# Altium schematic sheet MCU_Power.SchDoc
size A4; SheetNumber: 2; SheetTotal: 4
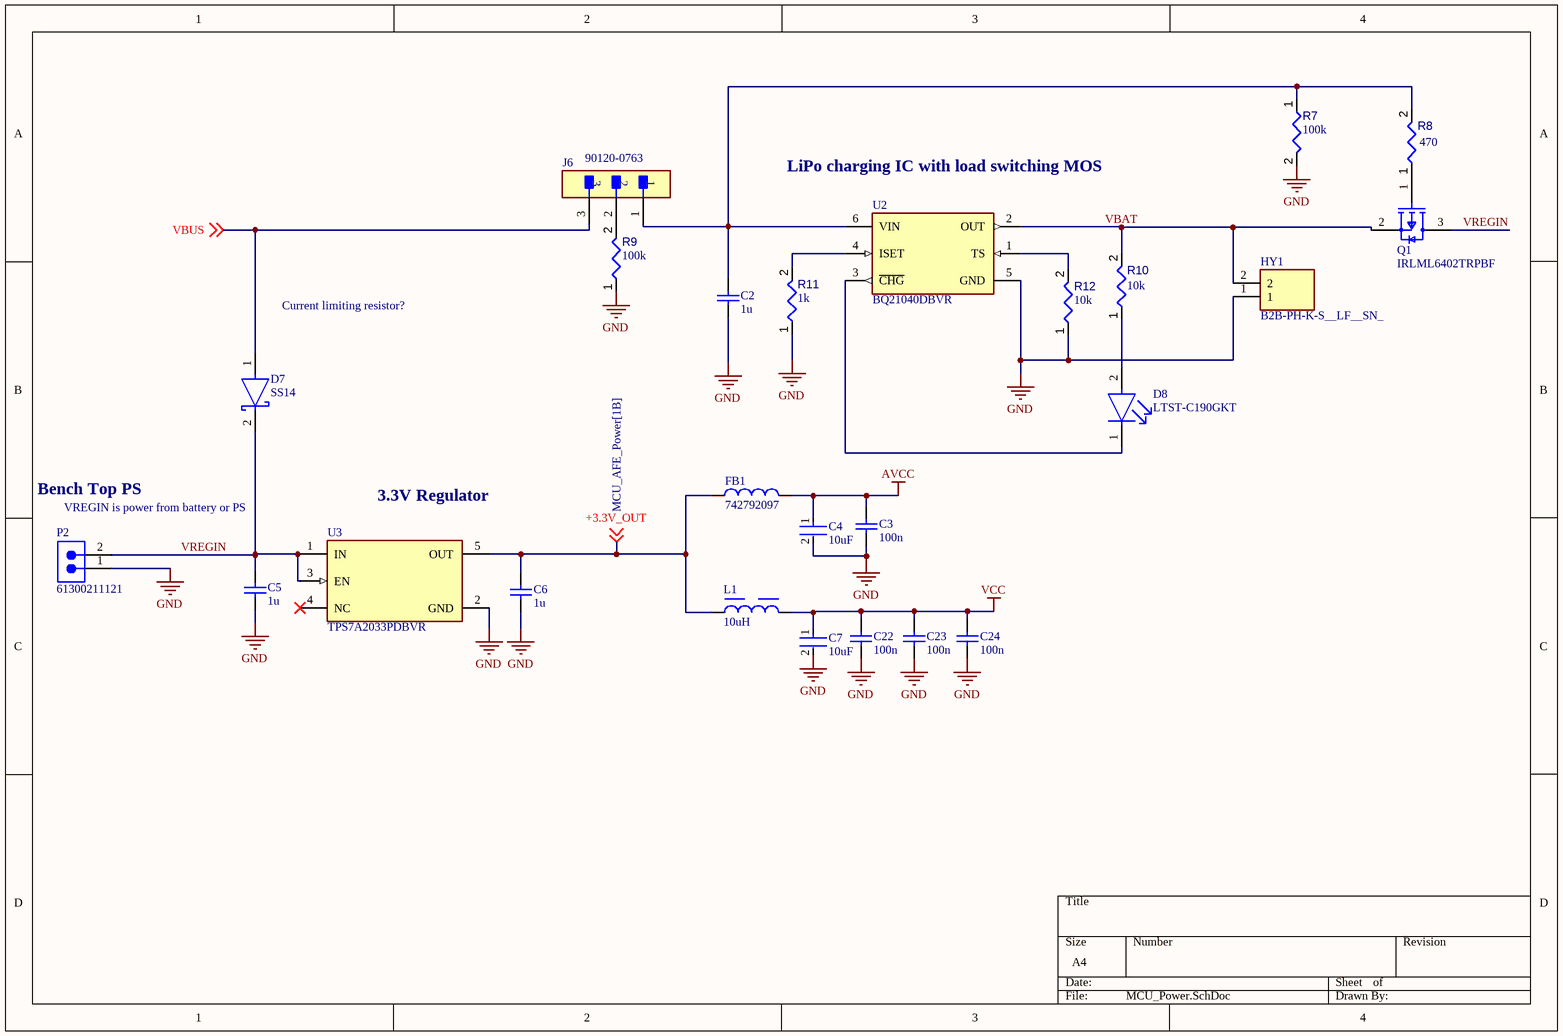
[diagram p0: MCU_Power.SchDoc]

## Parts
C2  1u  [WCAP-CSGP_0402_L1W0.5H0.5]
C3  100n  [WCAP-CSGP_0402_L1W0.5H0.5]
C4  10uF  [FP-GRM188-0_1-e0_2_0_55-IPC_A]
C5  1u  [WCAP-CSGP_0402_L1W0.5H0.5]
C6  1u  [WCAP-CSGP_0402_L1W0.5H0.5]
C7  10uF  [FP-GRM188-0_1-e0_2_0_55-IPC_A]
C22  100n  [WCAP-CSGP_0402_L1W0.5H0.5]
C23  100n  [WCAP-CSGP_0402_L1W0.5H0.5]
C24  100n  [WCAP-CSGP_0402_L1W0.5H0.5]
D7  SS14  [FP-403AE-MFG]
D8  LTST-C190GKT  [FP-LTST-C190GKT-MFG]
FB1  742792097  [WE-CBF_0805_L2W1.2H0.9_HC]
HY1  B2B-PH-K-S__LF__SN_  [B2BPHKSLFSN]
J6  90120-0763  [FP-90120-0763-MFG]
L1  10uH  [WE-LQS_2010]
P2  61300211121  [61300211121]
Q1  IRLML6402TRPBF  [FP-Micro3-MFG]
R7  value 100k  [RESC1005X40X25ML05T05]  (hidden comment: Resistor 4k7 +/-1% 0402 63 mW)
R8  value 470  [RESC1005X40X25ML05T05]  (hidden comment: Resistor 4k7 +/-1% 0402 63 mW)
R9  value 100k  [RESC1005X40X25ML05T05]  (hidden comment: Resistor 4k7 +/-1% 0402 63 mW)
R10  value 10k  [RESC1005X40X25ML05T05]  (hidden comment: Resistor 4k7 +/-1% 0402 63 mW)
R11  value 1k  [RESC1005X40X25ML05T05]  (hidden comment: Resistor 4k7 +/-1% 0402 63 mW)
R12  value 10k  [RESC1005X40X25ML05T05]  (hidden comment: Resistor 4k7 +/-1% 0402 63 mW)
U2  BQ21040DBVR  [FP-DBV0006A-MFG]
U3  TPS7A2033PDBVR  [FP-DBV0005A-MFG]

## Nets
AVCC: C3.2 C4.1 FB1.2
GND: C2.1 C3.1 C4.2 C5.1 C6.1 C7.2 C22.1 C23.1 C24.1 HY1.1 P2.1 R7.2 R9.1 R11.1 R12.1 U2.5(GND) U3.2(GND)
VCC: C7.1 C22.2 C23.2 C24.2 L1.2
+3.3V_OUT: C6.2 FB1.1 L1.1 U3.5(OUT) ; off-sheet +3.3V_OUT
VBAT: HY1.2 Q1.2(S) R10.2 U2.2(OUT)
VBUS: D7.1(A) J6.3 ; off-sheet VBUS
VREGIN: C5.2 D7.2(C) P2.2 Q1.3(D) U3.1(IN) U3.3(EN)
NetC2_2: C2.2 J6.1 R7.1 R8.2 U2.6(VIN)
NetD8_1: D8.1(C) U2.3(~{CHG})
NetD8_2: D8.2(A) R10.1
NetJ6_2: J6.2 R9.2
NetQ1_1: Q1.1(G) R8.1
NetR11_2: R11.2 U2.4(ISET)
NetR12_2: R12.2 U2.1(TS)

Not connected (* = marked no-connect by the designer): U3 4(NC)*

## Notes on the sheet
- (near U2) LiPo charging IC with load switching MOS
- Current limiting resistor?
- Bench Top PS
- (near P2) VREGIN is power from battery or PS
- (near U3) 3.3V Regulator

## Library data of the parts
C2 C3 C5 C6 C22-C24 = CMP-207839-000017-2: CAP CER 10000PF 50V X7R 0402; NexarPartId: 53703204; Insulation Resistance: 10GΩ; Material: Ceramic; Tolerance: 10%; Capacitance: 10nF; Packaging: Tape & Reel (TR); Voltage Rating: 50V; Thickness: 558.8µm; Case Code (Imperial): 0402; Dielectric: X7R; Mount: Surface Mount; Width: 500µm; Height: 500µm; Min Operating Temperature: -55°C; Case/Package: 0402; RoHS: Compliant; Case Code (Metric): 1005; REACH SVHC: Unknown; Max Operating Temperature: 125°C; Voltage Rating (DC): 50V; Length: 1mm
C4 C7 = CMP-2006-02792-2: Chip Multilayer Ceramic Capacitors for General Purpose, 0603, 10uF, X5R, 15%, 20%, 6.3V; Packaging: Tape and Reel; Voltage Rating (DC): 6.3V; Width: 0.031inch; Termination: SMD/SMT; Dielectric: X5R; Package Quantity: 4000; Voltage Rating: 6.3V; Capacitance: 10uF; Case/Package: 0603; Min Operating Temperature: -55°C; Voltage: 6.3V; Length: 1.6mm; Thickness: 0.035inch; Lead Free: Lead Free; Depth: 0.8mm; Case Code (Imperial): 0603; Max Operating Temperature: 85°C; Material: Ceramic; Height: 0.8mm; Tolerance: 20%; Mount: Surface Mount; REACH SVHC: No SVHC; Radiation Hardening: No; Case Code (Metric): 1608
D7 = CMP-2000-04943-2: DIODE SCHOTTKY 40V 1A SMA; Manufacturer: ON Semiconductor; Peak Reverse Current: 0.2mA; Max Junction Temp: +125°C; Standoff Height: 0.05mm; Max Surge Forward Current: 40A; Mouser Description: Schottky Diodes & Rectifiers SMA 40V 1.0A; RoHS: TRUE; Lead Free: Yes; Manufacturer Part Number: SS14; Device Class L3: Schottky Diodes; Category: Diode; Automotive: No; Digikey Description: DIODE SCHOTTKY 40V 1A SMA; ComponentLink2Description: Datasheet; Device Class L2: Diodes; Height: 2.5mm; Temperature Range High: +125°C; ComponentLink2URL: https://www.onsemi.com/pub/Collateral/SS19-D.PDF; Device Class L1: Discrete Semiconductors; Package: 403AE; Octopart: https://octopart.com/ss14-on+semiconductor-29205033; Max Repetitive Reverse Voltage: 40V; Temperature Range Low: -65°C; Forward Current: 1A; Temperature: -65°C to +125°C
D8 = CMP-22017-000005-2: LED GREEN CLEAR CHIP SMD; Dominant Wavelength: 569nm; Reverse Voltage: 5V; Lens Color: Colorless; Viewing Angle: 130°; Voltage: 2V; Forward Current: 30mA; Power Dissipation: 100mW; Luminous Intensity: 6mcd; Number of LEDs: 1; Forward Voltage: 2.1V; Wavelength: 565nm; Test Current: 10mA; Min Operating Temperature: -55°C; Lens Style: Clear; Mount: Surface Mount; Width: 0.8mm; Packaging: Tape and Reel; Lens Transparency: Clear; Case Code (Metric): 1608; Depth: 0.8mm; Case Code (Imperial): 0603; Case/Package: 0603; Number of Pins: 2; Max Operating Temperature: 85°C; Lead Free: Lead Free; Number of Elements: 1; Length: 1.6mm; Height: 0.8mm; Package Quantity: 1; Power Rating: 100mW; Radiation Hardening: No; Illumination Color: Green; Color: Green
FB1 = CMP-0220-00149-3: NexarPartId: 22803129; Max Current Rating: 1A; Inductance: 1.8nH; Resistance: 300mΩ; Number of Lines: 1; Test Frequency: 100MHz; Tolerance: 25%; Impedance: 1.5kΩ; Min Operating Temperature: -55°C; Core Material: Ferrite; Depth: 1.2mm; Lead Free: Lead Free; Length: 2mm; Packaging: Digi-Reel®; Case Code (Imperial): 0805; Current Rating: 1A; Max Operating Temperature: 125°C; Case Code (Metric): 2012; RoHS: Compliant; RMS Current (Irms): 1A; Mount: Surface Mount; Material: Ferrite; DC Resistance (DCR): 300mΩ; Height: 900µm; Series Resistance: 300mΩ; Termination: SMD/SMT; Max DC Current: 1A; Weight: 10.999615mg; REACH SVHC: Unknown; Width: 1.2mm; Case/Package: 0805
HY1 = B2B-PH-K-S__LF__SN_: Circulator or Directional Coupler; Manufacturer_Name: JST (JAPAN SOLDERLESS TERMINALS); Manufacturer_Part_Number: B2B-PH-K-S (LF)(SN); Datasheet Link: http://www.jst-mfg.com/product/pdf/eng/ePH.pdf; Height: 6mm
J6 = CMP-04776-000084-1: CONN HEADER VERT 3POS 2.54MM; Manufacturer: Molex; Voltage Rating: 350V; Number Of Contacts: 3; Conn Orientation: Vertical; Current Rating: 3A; Conn Gender: Male; Package: 90120-0763; ComponentLink2Description: Datasheet; Height: 5.8mm; Manufacturer Part Number: 90120-0763; Temperature Range High: +125°C; RoHS: TRUE; ComponentLink2URL: https://www.molex.com/webdocs/datasheets/pdf/en-us/0901200763_PCB_HEADERS.pdf; Device Class L2: Headers and Wire Housings; Temperature: -55°C to +125°C; Device Class L1: Connectors; Pitch: 2.54mm; Footprint Url: https://www.molex.com/pdm_docs/sd/901200763_sd.pdf; Device Class L3: unset; Temperature Range Low: -55°C; Number Of Rows: 1; Category: Conn; Lead Free: Yes; Mouser Description: Board-To-Board Connector, C-Grid III 90120 Series, Through Hole, Header, 3, 2.54 mm; Octopart: https://octopart.com/90120-0763-molex-655433; Contact Material: Gold,Nickel; Automotive: No; Digikey Description: CONN HEADER VERT 3POS 2.54MM
L1 = CMP-03913-77814850-1: 74404020100 WE-LQS SMT Semi-Shielded Power Inductor; Inductance Tolerance: 20%; Inductance: 10µH; DC Resistance (DCR): 860mΩ; Current Rating: 500mA; Width: 1.6mm; Height: 1mm; Ambient Temperature Range Low: -40°C; Length: 2mm; NexarPartId: 77814850; Ambient Temperature Range High: 85°C; RoHS: Compliant; Max Operating Temperature: 125°C; Min Operating Temperature: -40°C
P2 = CMP-1712-00002-6: NexarPartId: 20081794; Number of Contacts: 2; Pitch: 2.54mm; Connector Type: Male Pin; Voltage Rating: 250V; Current Rating: 3A; Gender: Male; Contact Resistance: 20mΩ; Height: 8.94mm; Lead Free: Lead Free; Number of Pins: 2; Termination: Through Hole; RoHS: Compliant; Lead Pitch: 2.54mm; REACH SVHC: No SVHC; Housing Material: PBT; Contact Mating Length: 5.9944mm; Min Operating Temperature: -40°C; Orientation: Vertical; Contact Material: Copper; Contact Gender: Male; Max Operating Temperature: 125°C; Number of Rows: 1; Number of Positions: 2; Packaging: Bulk; Contact Plating: Gold; Mount: Through Hole; Color: Black; Operating Supply Voltage: 250V
Q1 = CMP-32901-000130-1: MOSFET P-CH 20V 3.7A SOT-23; Manufacturer: Infineon; Reverse Recovery Time: 29ns; Max Forward Diode Voltage: -1.2V; Input Capacitace At Vds: 633pF @ -10V; Drain To Source Resistance: 0.05Ω; Gate To Source Voltage: 12V; Max Junction Temp: +150°C; Pulse Drain Current: -22A; Threshold Vgs Min: -0.4V; Turn Off Delay Time: 588ns; Number Of Channels: 1; Power Dissipation: 1.3W; Turn On Delay Time: 350ns; Drain To Source Breakdown Voltage: -20V; Continuous Drain Current: -3.7A; Depletion Mode: False; Gate Charge At Vgs: 8nC @ -5V; Rthja Max: 75°C/W; Threshold Vgs: -0.55V; Standoff Height: 0.01mm; Reverse Recovery Charge: 11nC; Device Class L2: Transistors; Ipc Land Pattern Name: SOT95P237X100-3; Temperature Range High: +150°C; Octopart: https://octopart.com/irlml6402trpbf-infineon-65874989; ComponentLink2URL: https://www.infineon.com/dgdl/irlml6402pbf.pdf?fileId=5546d462533600a401535668d5c2263c; Automotive: No; Manufacturer Part Number: IRLML6402TRPBF; Height: 1.12mm; Drain To Source Voltage: -20V; Digikey Description: MOSFET P-CH 20V 3.7A SOT-23; Device Class L1: Discrete Semiconductors; Package: Micro3; Lead Free: Yes; Temperature Range Low: -55°C; Number Of P Channels: 1; Technology: MOSFET; Temperature: -55°C to +150°C; Category: Trans; Footprint Url: http://irf.com/package/outline/po_micro3.pdf; RoHS: TRUE; Device Class L3: MOSFETs; Threshold Vgs Max: -1.2V; ComponentLink2Description: Datasheet
R7-R12 = CMP-009-00034-5: Chip Resistor, 4.7 KOhm, +/- 1%, 63 mW, -55 to 155 degC, 0402 (1005 Metric); Power: 63mW; Voltage Rating: 50V; Case/Package: 0402; Tolerance: 1%; Max Operating Temperature: 155°C; Pins: 2; RoHS Compliant: True; Min Operating Temperature: -55°C; Mounting Technology: SM
U2 = CMP-04911-000045-1: IC BATT CHG LI-ION 1CELL SOT23-6; Differential Output: No; Settling Time: 30us; Fault Protection: Over Voltage; Number of Bits: 16; Output Type: Analog Current/Voltage; Interface: USB; Number of Cells: 1; Max Supply Voltage: 6.45V; Battery Pack Voltage: 4.2V; Max Charge Current: 800mA; Number of D/A Converters: 4; Mount: Surface Mount; Case/Package: SOT-23-6; RoHS Compliant: Yes; Packaging: Cut Tape; Min Operating Temperature: 0°C; Lead Free: Lead Free; Max Operating Temperature: 125°C
U3 = CMP-04917-000300-1: IC REG LINEAR 3.3V 300MA SOT23-5; RoHS Compliant: Yes